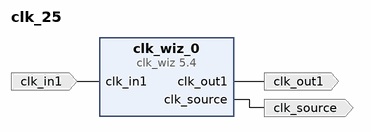
[diagram p0: block diagram of the top level]
# Vivado block design clk_25, xc7a35tcpg236-1, Vivado 2017.2.1
create_bd_design clk_25

create_bd_port -dir I -type clk clk_in1
create_bd_port -dir O -type clk clk_out1
set_property -dict {CONFIG.FREQ_HZ 25000000} [get_bd_ports clk_out1]
create_bd_port -dir O -type clk clk_source

create_bd_cell -type ip -vlnv xilinx.com:ip:clk_wiz:5.4 clk_wiz_0
set_property -dict [list \
  CONFIG.PRIMITIVE PLL \
  CONFIG.CLKOUT2_USED true \
  CONFIG.NUM_OUT_CLKS 2 \
  CONFIG.CLK_OUT2_PORT clk_source \
  CONFIG.CLKOUT1_REQUESTED_OUT_FREQ 25 \
  CONFIG.CLKOUT1_DRIVES BUFG \
  CONFIG.CLKOUT2_DRIVES BUFG \
  CONFIG.CLKOUT3_DRIVES BUFG \
  CONFIG.CLKOUT4_DRIVES BUFG \
  CONFIG.CLKOUT5_DRIVES BUFG \
  CONFIG.CLKOUT6_DRIVES BUFG \
  CONFIG.CLKOUT7_DRIVES BUFG \
  CONFIG.USE_LOCKED false \
  CONFIG.USE_RESET false \
  CONFIG.MMCM_DIVCLK_DIVIDE 1 \
  CONFIG.MMCM_CLKFBOUT_MULT_F 9 \
  CONFIG.MMCM_COMPENSATION ZHOLD \
  CONFIG.MMCM_CLKOUT0_DIVIDE_F 36 \
  CONFIG.MMCM_CLKOUT1_DIVIDE 9 \
  CONFIG.CLKOUT1_JITTER 183.467 \
  CONFIG.CLKOUT1_PHASE_ERROR 105.461 \
  CONFIG.CLKOUT2_JITTER 137.681 \
  CONFIG.CLKOUT2_PHASE_ERROR 105.461 \
] [get_bd_cells clk_wiz_0]

# ---- connections ----

connect_bd_net -net clk_in1_1 [get_bd_ports clk_in1] [get_bd_pins clk_wiz_0/clk_in1]
connect_bd_net [get_bd_pins clk_wiz_0/clk_out1] [get_bd_ports clk_out1]
connect_bd_net [get_bd_pins clk_wiz_0/clk_source] [get_bd_ports clk_source]

validate_bd_design
save_bd_design
